# EAGLE design MDMCv2 (EAGLE 7.7.0)
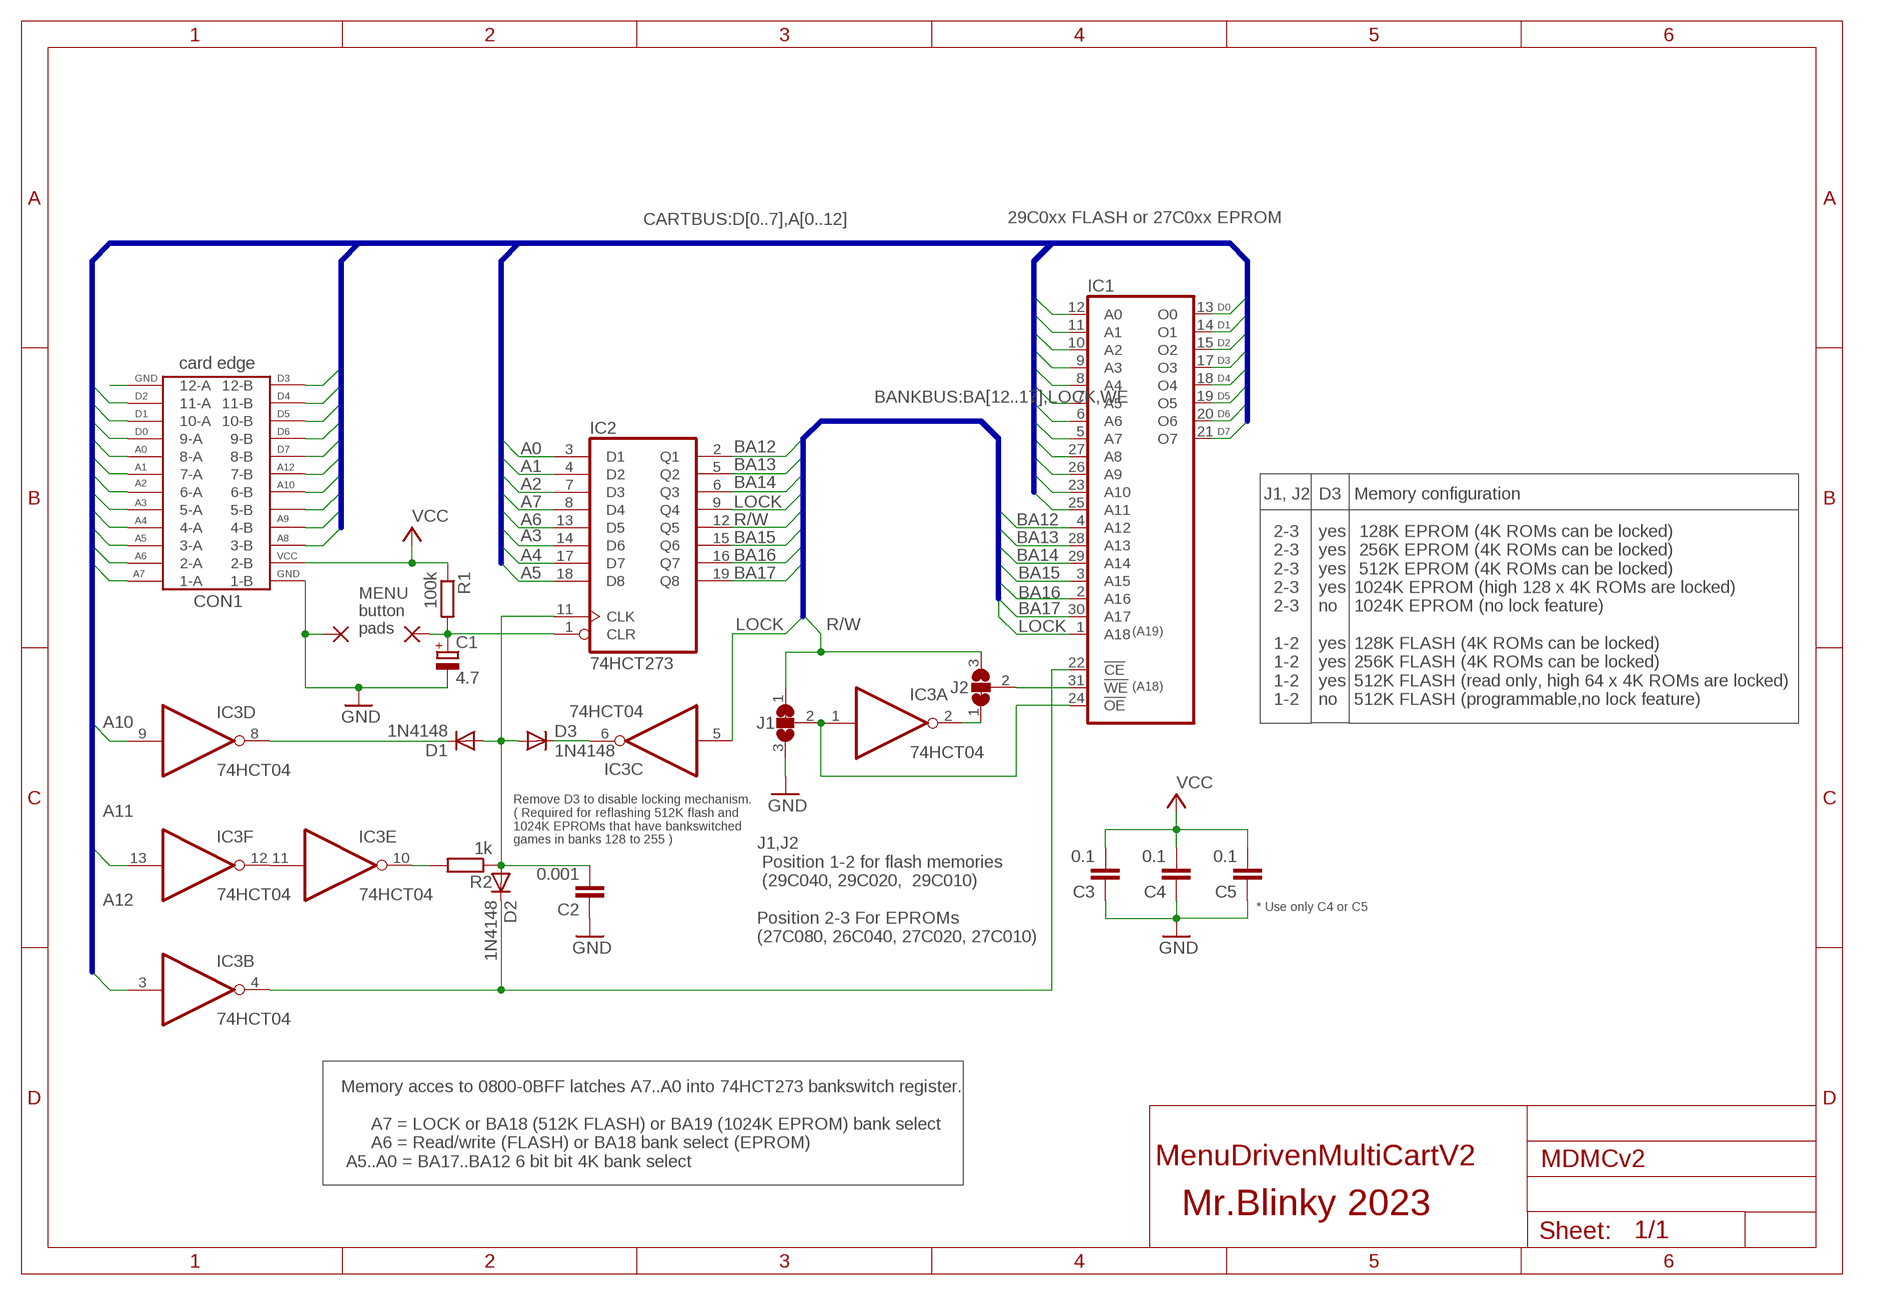
[diagram p0: schematic, sheet 1]

## Parts
C1  4.7  CPOL-EUTT2D5L  [TT2D5L]
C2  0.001  C-EU050-025X075  [C050-025X075]
C3  0.1  C-EU050-025X075  [C050-025X075]
C4  0.1  C-EU050-025X075  [C050-025X075]
C5  0.1  C-EU050-025X075  [C050-025X075]
CON1  card edge  24PINEDGE-254MM  [24PINEDGE-254MM]
D1  1N4148  1N4148DO35-7  [DO35-7]
D2  1N4148  1N4148DO35-7  [DO35-7]
D3  1N4148  1N4148DO35-7  [DO35-7]
IC1  29C0xx FLASH or 27C0xx EPROM  29C04032P6  [DIL32]
IC2  74HCT273  74HCT273N  [DIL20]
IC3  74HCT04  74LS04N  [DIL14]
J1  SJ2W  [SJ_2]
J2  SJ2W  [SJ_2]
MB1  WIREPAD1,6/0,9  [1,6/0,9]
MB2  WIREPAD1,6/0,9  [1,6/0,9]
R1  100k  R-EU_0207/7  [0207/7]
R2  1k  R-EU_0207/7  [0207/7]

## Nets
!RESET: C1.+ IC2.1(CLR) MB1.1(P) R1.2
/A10: D1.C IC3.8(D:O)
/A11: IC3.11(E:I) IC3.12(F:O)
/CE: D2.C IC1.22(!CE) IC3.4(B:O)
/LOCK: D3.C IC3.6(C:O)
/OE: IC1.24(!OE) IC3.1(A:I) J1.2
/WE: IC1.31(!WE) J2.2
/WEJ2: IC3.2(A:O) J2.1
A0: CON1.8-A IC1.12(A0) IC2.3(D1)
A1: CON1.7-A IC1.11(A1) IC2.4(D2)
A2: CON1.6-A IC1.10(A2) IC2.7(D3)
A3: CON1.5-A IC1.9(A3) IC2.14(D6)
A4: CON1.4-A IC1.8(A4) IC2.17(D7)
A5: CON1.3-A IC1.7(A5) IC2.18(D8)
A6: CON1.2-A IC1.6(A6) IC2.13(D5)
A7: CON1.1-A IC1.5(A7) IC2.8(D4)
A8: CON1.3-B IC1.27(A8)
A9: CON1.4-B IC1.26(A9)
A10: CON1.6-B IC1.23(A10) IC3.9(D:I)
A11: CON1.5-B IC1.25(A11) IC3.13(F:I)
A11B: IC3.10(E:O) R2.2
A12: CON1.7-B IC3.3(B:I)
BA12: IC1.4(A12) IC2.2(Q1)
BA13: IC1.28(A13) IC2.5(Q2)
BA14: IC1.29(A14) IC2.6(Q3)
BA15: IC1.3(A15) IC2.15(Q6)
BA16: IC1.2(A16) IC2.16(Q7)
BA17: IC1.30(A17) IC2.19(Q8)
CLK: C2.2 D1.A D2.A D3.A IC2.11(CLK) R2.1
D0: CON1.9-A IC1.13(O0)
D1: CON1.10-A IC1.14(O1)
D2: CON1.11-A IC1.15(O2)
D3: CON1.12-B IC1.17(O3)
D4: CON1.11-B IC1.18(O4)
D5: CON1.10-B IC1.19(O5)
D6: CON1.9-B IC1.20(O6)
D7: CON1.8-B IC1.21(O7)
GND: C1.- C2.1 C3.1 C4.1 C5.1 CON1.1-B CON1.12-A J1.3 MB2.1(P)
LOCK: IC1.1(A18) IC2.9(Q4) IC3.5(C:I)
R/W: IC2.12(Q5) J1.1 J2.3
VCC: C3.2 C4.2 C5.2 CON1.2-B R1.1

## Buses
CARTBUS:D[0..7],A[0..12]
BANKBUS:BA[12..17],LOCK,WE

## Notes on the sheet
- MENU
  button
  pads
- (A19)
- (A18)
- J1, J2
  
    2-3
    2-3
    2-3
    2-3
    2-3
  
    1-2
    1-2
    1-2
    1-2
- D3
  
  yes
  yes
  yes
  yes
  no
  
  yes
  yes
  yes
  no
- Memory configuration
  
   128K EPROM (4K ROMs can be locked)
   256K EPROM (4K ROMs can be locked)
   512K EPROM (4K ROMs can be locked)
  1024K EPROM (high 128 x 4K ROMs are locked)
  1024K EPROM (no lock feature)
  
  128K FLASH (4K ROMs can be locked)
  256K FLASH (4K ROMs can be locked)
  512K FLASH (read only, high 64 x 4K ROMs are locked)
  512K FLASH (programmable,no lock feature)
- Remove D3 to disable locking mechanism.
  ( Required for reflashing 512K flash and
  1024K EPROMs that have bankswitched 
  games in banks 128 to 255 )
- * Use only C4 or C5
- J1,J2
   Position 1-2 for flash memories
   (29C040, 29C020,  29C010)
  
  Position 2-3 For EPROMs
  (27C080, 26C040, 27C020, 27C010)
- MenuDrivenMultiCartV2
- Memory acces to 0800-0BFF latches A7..A0 into 74HCT273 bankswitch register.
  
        A7 = LOCK or BA18 (512K FLASH) or BA19 (1024K EPROM) bank select
        A6 = Read/write (FLASH) or BA18 bank select (EPROM)
   A5..A0 = BA17..BA12 6 bit bit 4K bank select
- Mr.Blinky 2023

## Power pins joined to a net without a drawn wire
GND: IC1.16(GND) IC2.10(GND) IC3.7(P:GND)
VCC: IC1.32(VCC) IC2.20(VCC) IC3.14(P:VCC)

## Library data of the parts
C1 = rcl:CPOL-EU: POLARIZED CAPACITOR, European symbol
C2-C5 = rcl:C-EU: CAPACITOR, European symbol
CON1 = ataricon-edge:24PINEDGE-254MM: 24 PIN EDGE CONNECTOR 2.54mm ATARI 2600 CARTRIDGE PORT
D1-D3 = diode:1N4148: DIODE high speed (Philips)
IC1 = atmel:29C040: 4-Megabit (512Kx8) FLASH
IC2 = 74xx-eu:74*273: Octal D type FLIP FLOP, clear
IC3 = 74xx-us:74*04: Hex INVERTER
J1 J2 = jumper:SJ2W: SMD solder JUMPER
MB1 MB2 = wirepad:WIREPAD: Wire PAD connect wire on PCB
R1 R2 = rcl:R-EU_: RESISTOR, European symbol

## Board
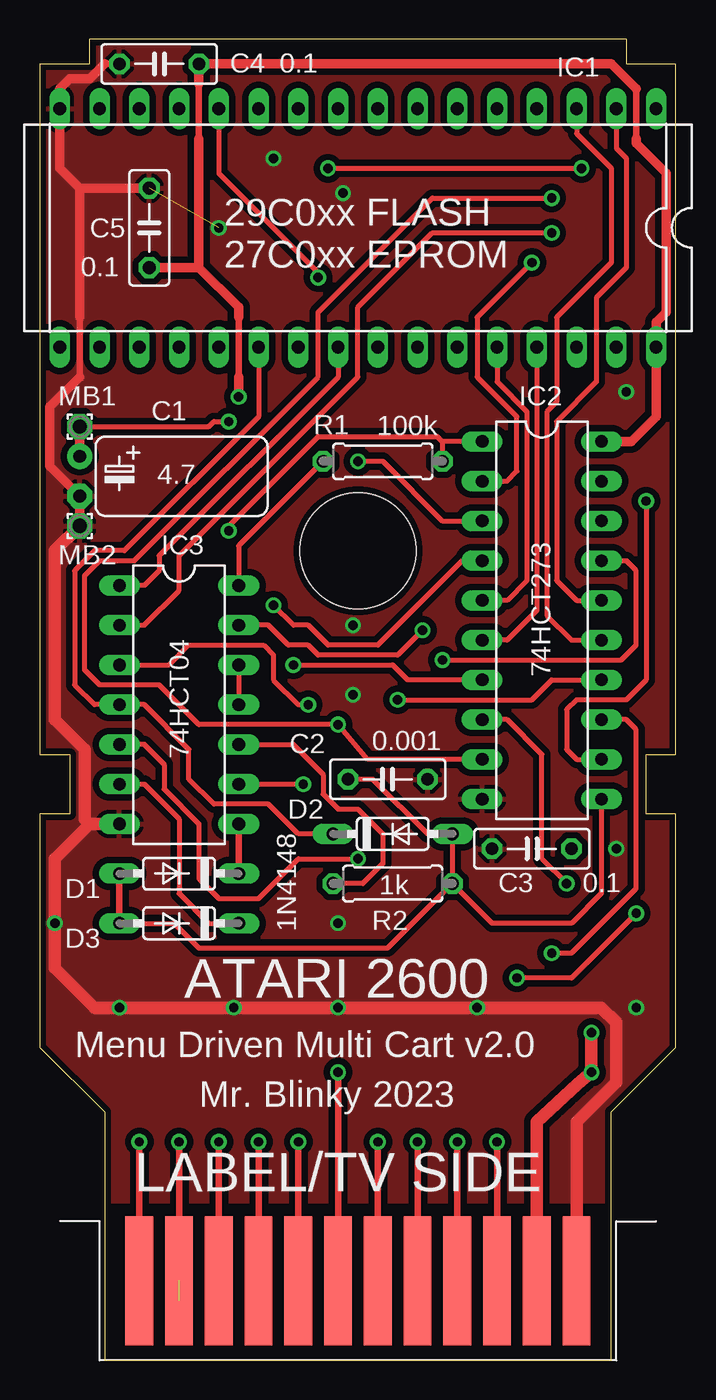
[diagram p1: board, top side]
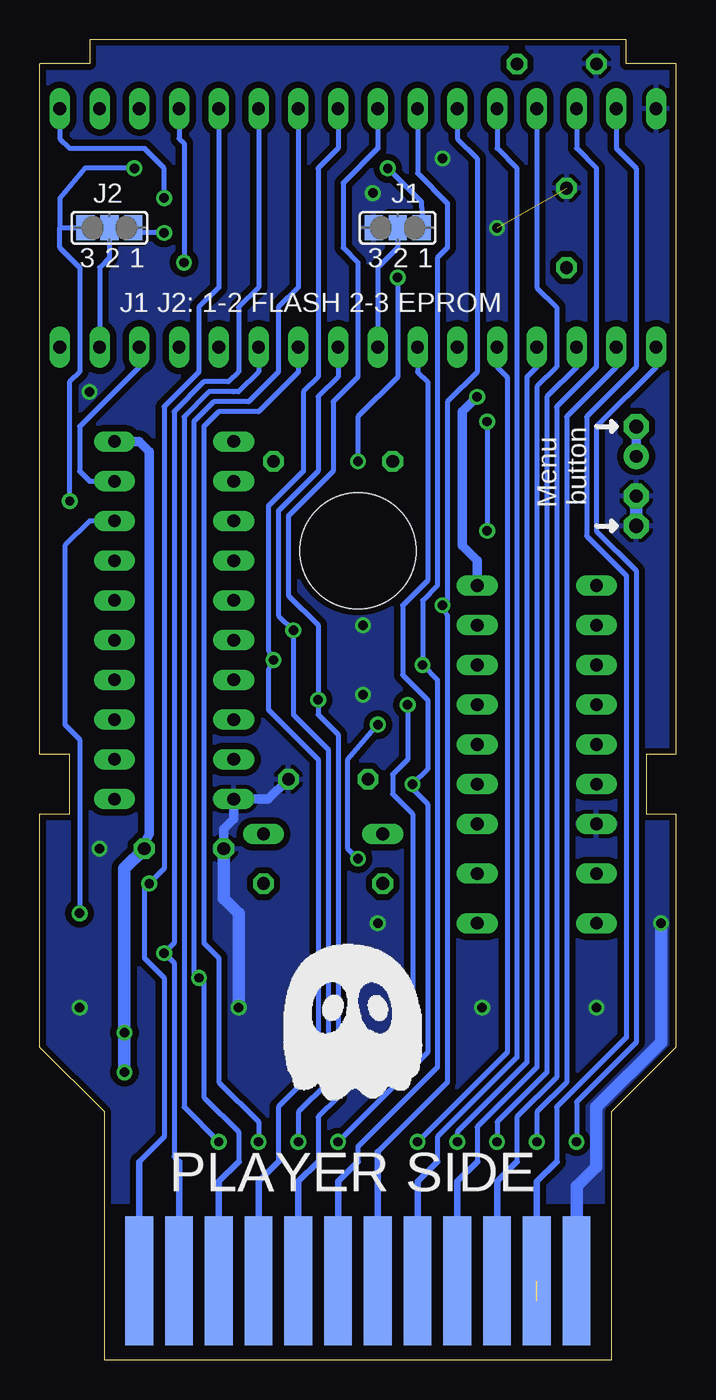
[diagram p2: board, bottom side, seen from below]

Size 40.64 x 84.46 mm. Coordinates in mm from the lower left corner, seen from the top.
Outline: 4.13,0 36.51,0 36.51,15.88 40.64,20 40.64,34.92 38.73,34.92 38.73,38.73 40.64,38.73 40.64,82.87 37.47,82.87 37.47,84.46 3.18,84.46 3.18,82.87 0,82.87 0,38.73 1.91,38.73 1.91,34.92 0,34.92 0,20 4.13,15.88 4.13,0
Copper layers (1*16): Top 0.035mm / dielectric 1.5mm / Bottom 0.035mm
Design rules "default *": minimum track width 8mil, minimum drill 0.3mm, track to track 6mil, track to pad 6mil, pad to pad 6mil, via to via 6mil, smd to smd 6mil, copper to edge 12mil, drill to drill 8mil, minimum pad ring 10mil, minimum via ring 8mil, stop-mask expansion 4mil, vias tented up to drill 30mil, thermal gap 10mil
Holes 7.41 mm at 20.32,51.75

### Footprints (pad centres in the part's own frame; a part is rotated, then mirrored left to right if it is on the bottom)
TT2D5L = drill 0.813 pad 1.6: + -1.27,0 | drill 0.813 pad 1.6 octagon: - 1.27,0
C050-025X075 = drill 0.813 octagon: 1 -2.54,0; 2 2.54,0
24PINEDGE-254MM = smd 1.778 x 8.255: 1-A -22.86,-7.62; 2-A -20.32,-7.62; 3-A -17.78,-7.62; 4-A -15.24,-7.62; 5-A -12.7,-7.62; 6-A -10.16,-7.62; 7-A -7.62,-7.62; 8-A -5.08,-7.62; 9-A -2.54,-7.62; 10-A 0,-7.62; 11-A 2.54,-7.62; 12-A 5.08,-7.62 | smd 1.778 x 8.255 bottom: 1-B -22.86,-7.62; 2-B -20.32,-7.62; 3-B -17.78,-7.62; 4-B -15.24,-7.62; 5-B -12.7,-7.62; 6-B -10.16,-7.62; 7-B -7.62,-7.62; 8-B -5.08,-7.62; 9-B -2.54,-7.62; 10-B 0,-7.62; 11-B 2.54,-7.62; 12-B 5.08,-7.62
DO35-7 = drill 0.813 long: A 3.81,0; C -3.81,0
DIL32 = drill 0.813 long: 1 -19.05,-7.62; 2 -16.51,-7.62; 3 -13.97,-7.62; 4 -11.43,-7.62; 5 -8.89,-7.62; 6 -6.35,-7.62; 7 -3.81,-7.62; 8 -1.27,-7.62; 9 1.27,-7.62; 10 3.81,-7.62; 11 6.35,-7.62; 12 8.89,-7.62; 13 11.43,-7.62; 14 13.97,-7.62; 15 16.51,-7.62; 16 19.05,-7.62; 17 19.05,7.62; 18 16.51,7.62; 19 13.97,7.62; 20 11.43,7.62; 21 8.89,7.62; 22 6.35,7.62; 23 3.81,7.62; 24 1.27,7.62; 25 -1.27,7.62; 26 -3.81,7.62; 27 -6.35,7.62; 28 -8.89,7.62; 29 -11.43,7.62; 30 -13.97,7.62; 31 -16.51,7.62; 32 -19.05,7.62
DIL20 = drill 0.813 long: 1 -11.43,-3.81; 2 -8.89,-3.81; 3 -6.35,-3.81; 4 -3.81,-3.81; 5 -1.27,-3.81; 6 1.27,-3.81; 7 3.81,-3.81; 8 6.35,-3.81; 9 8.89,-3.81; 10 11.43,-3.81; 11 11.43,3.81; 12 8.89,3.81; 13 6.35,3.81; 14 3.81,3.81; 15 1.27,3.81; 16 -1.27,3.81; 17 -3.81,3.81; 18 -6.35,3.81; 19 -8.89,3.81; 20 -11.43,3.81
DIL14 = drill 0.813 long: 1 -7.62,-3.81; 2 -5.08,-3.81; 3 -2.54,-3.81; 4 0,-3.81; 5 2.54,-3.81; 6 5.08,-3.81; 7 7.62,-3.81; 8 7.62,3.81; 9 5.08,3.81; 10 2.54,3.81; 11 0,3.81; 12 -2.54,3.81; 13 -5.08,3.81; 14 -7.62,3.81
SJ_2 = smd 1.168 x 1.6: 1 -1.524,0; 2 0,0; 3 1.524,0
1,6/0,9 = drill 0.914 pad 1.6 octagon: 1 0,0
0207/7 = drill 0.813 octagon: 1 -3.81,0; 2 3.81,0

### Placement (x,y rotation side)
C1  2.54,56.52 270 top
C2  22.22,37.15 180 top
C3  31.43,32.7 0 top
C4  7.62,82.87 0 top
C5  6.98,72.39 270 top
CON1  11.43,12.7 0 bottom
D1  8.89,31.12 180 top
D2  22.54,33.66 0 top
D3  8.89,27.94 180 top
IC1  20.32,72.39 180 top
IC2  32.07,47.31 270 top
IC3  8.89,41.91 270 top
J1  17.78,72.39 180 bottom
J2  36.19,72.39 180 bottom
MB1  2.54,59.69 180 top
MB2  2.54,53.34 180 top
R1  21.91,57.47 0 top
R2  22.54,30.48 180 top

### Tracks (layer width: path | path; a pad name or v marks a point on that pad's centre or on a via)
!RESET  (via drill 0.6)
  Top 0.305: IC2.1 25.72,58.74 | 25.72,58.74 R1.2 | MB1.1 10.79,59.69 11.11,60.01 v12.07,60.01 | v12.07,53.02 12.07,53.34 17.78,59.05 25.4,59.05 25.72,58.74
  Top 0.61: C1.+ MB1.1
  Bottom 0.305: v12.07,60.01 v12.07,53.02
  Bottom 0.61: MB1.1 C1.+
/A10
  Top 0.406: D1.C IC3.8
/A11
  Top 0.305: IC3.12 IC3.11
/CE
  Top 0.305: IC1.22 13.97,60.33 5.4,51.75 3.49,51.75 2.22,50.48 2.22,43.18 3.49,41.91 IC3.4 6.67,41.91 9.52,39.05 9.52,37.15 11.11,35.56 14.61,35.56 16.51,33.66 D2.C
/LOCK
  Top 0.305: IC3.6 6.67,36.83 8.89,34.61 8.89,29.84 10.79,27.94 D3.C
/OE
  Top 0.305: IC1.24 19.05,62.87 7.62,51.44 7.62,50.48 6.67,49.53 IC3.1
  Bottom 0.305: J1.2 17.78,71.12 19.05,69.85 IC1.24
/WE
  Bottom 0.305: J2.2 36.19,70.49 36.83,69.85 IC1.31
/WEJ2  (via drill 0.6)
  Top 0.305: IC3.2 6.67,46.99 8.89,49.21 8.89,51.44 20.32,62.87 20.32,67.31 25.08,72.07 v32.7,72.07
  Bottom 0.305: v32.7,72.07 34.29,72.07 34.61,72.39 J2.1
A0  (via drill 0.6)
  Top 0.305: IC1.12 11.43,75.88 17.78,69.53 v17.78,69.22 | v20.32,57.47 21.91,57.47 25.72,53.66 IC2.3
  Bottom 0.305: IC1.12 11.43,77.47 10.16,76.2 10.16,19.37 15.24,14.29 15.24,12.7 | v17.78,69.22 17.78,62.87 20.32,60.33 v20.32,57.47
  Bottom 0.406: 15.24,12.7 16.51,11.43 CON1.8-A
A1  (via drill 0.6)
  Top 0.305: IC2.4 26.99,51.12 21.59,45.72 18.42,45.72 17.14,46.99 16.19,46.99 v14.92,48.26 14.61,48.26
  Bottom 0.305: IC1.11 13.97,78.1 12.7,76.84 12.7,63.18 14.61,61.28 14.61,48.58 v14.92,48.26 14.61,47.62 14.61,17.78 19.05,13.34
  Bottom 0.406: 19.05,13.34 CON1.7-A
A2  (via drill 0.6)
  Top 0.305: IC2.7 23.5,43.5 22.54,44.45 v16.19,44.45
  Bottom 0.305: IC1.10 16.51,75.88 14.61,73.98 14.61,71.12 15.24,70.49 15.24,49.53 16.19,48.58 v16.19,44.45 15.24,43.5 15.24,18.73 20.32,13.65 20.32,12.7
  Bottom 0.406: 20.32,12.7 21.59,11.43 CON1.6-A
A3  (via drill 0.6)
  Top 0.305: v22.86,42.23 31.43,42.23 32.7,43.5 IC2.14
  Bottom 0.305: IC1.9 19.05,77.47 21.27,75.25 21.27,71.12 20.32,70.17 20.32,62.87 21.91,61.28 21.91,56.83 24.76,53.98 24.76,48.9 22.86,46.99 v22.86,42.23 22.86,41.27 21.59,40.01 21.59,16.83 22.86,15.56 22.86,12.7
  Bottom 0.406: 22.86,12.7 24.13,11.43 CON1.5-A
A4  (via drill 0.6)
  Top 0.305: v25.72,44.77 37.15,44.77 38.1,45.72 38.1,50.48 37.47,51.12 IC2.17
  Bottom 0.305: IC1.8 21.59,77.47 22.86,76.2 22.86,62.87 23.81,61.91 23.81,56.83 26.04,54.61 26.04,45.4 v25.72,44.77 26.04,44.13 26.04,41.59 22.86,38.42 22.86,18.73 25.4,16.19 25.4,12.7 | 26.67,4.13 CON1.4-A 26.67,4.45
  Bottom 0.406: 25.4,12.7 26.67,11.43 CON1.4-A
A5  (via drill 0.6)
  Top 0.305: v38.1,28.57 33.97,24.45 v30.48,24.45
  Bottom 0.305: IC1.7 24.13,68.58 25.4,67.31 25.4,63.18 27.3,61.28 29.53,61.28 30.8,60.01 30.8,24.77 v30.48,24.45 30.16,24.13 30.16,16.83 27.94,14.61 27.94,12.7 | 29.21,3.81 CON1.3-A | IC2.18 37.47,53.66 39.05,52.07 39.05,40.64 38.1,39.69 v38.1,28.57
  Bottom 0.406: 27.94,12.7 29.21,11.43 CON1.3-A
A6  (via drill 0.6)
  Top 0.305: v32.7,26.04 33.97,26.04 38.1,30.16 38.1,40.32 37.47,40.96 IC2.13
  Bottom 0.305: IC1.6 26.67,68.58 27.94,67.31 27.94,63.18 28.57,62.55 30.16,62.55 32.07,60.64 32.07,26.67 v32.7,26.04 32.07,25.4 32.07,13.02 31.75,12.7
  Bottom 0.406: 31.75,12.7 CON1.2-A
A7  (via drill 0.6)
  Top 0.305: v33.66,30.48 32.07,32.07 32.07,38.73 29.85,40.96 IC2.8
  Bottom 0.305: IC1.5 29.21,68.58 30.48,67.31 30.48,63.18 32.7,60.96 32.7,31.43 v33.66,30.48 33.97,30.16 33.97,25.72 32.7,24.45 32.7,14.29 34.29,12.7
  Bottom 0.406: 34.29,12.7 CON1.1-A
A8  (via drill 0.6)
  Top 0.305: 29.21,2.86 CON1.3-B | CON1.3-B 29.21,5.71 28.89,6.03 28.89,5.4 CON1.3-B
  Top 0.406: v29.21,13.97 29.21,5.71
  Bottom 0.305: IC1.27 26.67,63.18 27.94,61.91 28.26,61.91 29.85,61.91 31.43,60.33 31.43,16.19 v29.21,13.97
A9  (via drill 0.6)
  Top 0.406: v26.67,13.97 CON1.4-B
  Bottom 0.305: IC1.26 24.13,63.18 26.67,60.64 29.21,60.64 30.16,59.69 30.16,26.67 29.21,25.72 29.21,17.78 26.67,15.24 v26.67,13.97
A10  (via drill 0.6)
  Top 0.305: IC3.9 v16.83,36.83
  Top 0.406: v21.59,13.97 CON1.6-B
  Bottom 0.305: IC1.23 16.51,63.18 15.88,62.55 15.88,49.85 17.46,48.26 17.46,43.81 15.88,42.23 15.88,37.78 v16.83,36.83 16.83,36.51 15.88,35.56 15.88,19.69 v21.59,13.97
A11  (via drill 0.6)
  Top 0.305: v24.45,46.67 22.86,45.09 17.78,45.09 17.14,45.72 15.88,45.72 14.61,46.99 IC3.13
  Top 0.406: v24.13,13.97 CON1.5-B
  Bottom 0.305: IC1.25 21.59,62.87 22.86,61.59 22.86,56.83 25.4,54.29 25.4,47.62 v24.45,46.67 24.45,41.27 22.22,39.05 22.22,17.78 24.13,15.88 v24.13,13.97
A11B
  Top 0.305: IC3.10 16.19,39.37 18.1,37.47 18.1,36.2 19.05,35.24 20.32,35.24 21.91,33.66 21.91,31.75 20.64,30.48 R2.2
A12  (via drill 0.6)
  Top 0.305: IC3.3 8.25,44.45 9.52,45.72 14.29,45.72 14.92,45.09 14.92,43.5 16.51,41.91 v17.14,41.91
  Top 0.406: CON1.7-B v19.05,18.41
  Bottom 0.305: v17.14,41.91 17.14,38.42 18.1,37.47 18.1,36.2 16.83,34.92 16.83,20.64 v19.05,18.41
BA12  (via drill 0.6)
  Top 0.305: IC2.2 29.85,56.2 30.48,56.83 30.48,60.33 27.94,62.87 27.94,66.67 v31.43,70.17
  Bottom 0.305: IC1.4 31.75,78.1 31.43,77.79 v31.43,70.17
BA13
  Top 0.305: IC1.28 29.21,62.55 31.11,60.64 31.11,49.85 29.85,48.58 IC2.5
BA14
  Top 0.305: IC1.29 31.75,47.94 29.85,46.04 IC2.6
BA15
  Top 0.305: IC1.3 34.29,78.42 36.51,76.2 36.51,70.17 33.02,66.67 33.02,61.28 32.39,60.64 32.39,47.62 33.97,46.04 IC2.15
BA16
  Top 0.305: IC1.2 36.83,77.47 37.47,76.84 37.47,69.85 35.56,67.94 35.56,62.55 33.02,60.01 33.02,49.85 34.29,48.58 IC2.16
BA17
  Bottom 0.305: IC1.30 34.29,63.5 38.1,59.69 38.1,56.83 37.47,56.2 IC2.19
CLK
  Top 0.305: IC2.11 35.88,29.84 33.97,27.94 28.89,27.94 R2.1 | C2.2 21.27,37.15 24.76,33.66 D2.A R2.1 | D3.A 8.57,27.94 10.16,26.35 22.22,26.35 R2.1 | R2.1 26.35,30.16
  Top 0.406: D1.A D3.A
D0
  Bottom 0.305: IC1.13 8.89,68.58 7.62,67.31 7.62,63.5 8.89,62.23 8.89,18.73 12.7,14.92 12.7,12.7 | 13.97,3.18 CON1.9-A
  Bottom 0.406: 12.7,12.7 13.97,11.43 CON1.9-A
D1
  Bottom 0.305: IC1.14 6.35,77.47 5.08,76.2 5.08,63.5 7.62,60.96 7.62,18.1 10.16,15.56 10.16,12.7 | 11.43,3.81 CON1.10-A
  Bottom 0.406: 10.16,12.7 11.43,11.43 CON1.10-A
D2  (1 unrouted)
  Bottom 0.305: IC1.15 3.81,77.47 2.54,76.2 2.54,63.5 5.71,60.33 5.71,52.7 3.18,50.16 3.18,20.64 7.62,16.19 7.62,12.7
  Bottom 0.406: 7.62,12.7 8.89,11.43 8.89,3.81
D3  (via drill 0.6)
  Top 0.406: v6.35,13.97 6.35,8.89 6.98,8.26 6.98,5.71 CON1.12-B
  Bottom 0.305: IC1.17 1.27,63.5 5.08,59.69 5.08,53.02 2.54,50.48 2.54,20.32 6.35,16.51 v6.35,13.97
D4  (via drill 0.6)
  Top 0.406: v8.89,13.97 CON1.11-B 8.89,4.45
  Bottom 0.305: IC1.18 3.81,63.5 6.98,60.33 6.98,17.78 8.89,15.88 v8.89,13.97
D5  (via drill 0.6)
  Top 0.406: v11.43,13.97 CON1.10-B
  Bottom 0.305: IC1.19 6.35,63.5 8.25,61.59 8.25,18.41 11.43,15.24 v11.43,13.97
D6  (via drill 0.6)
  Top 0.406: v13.97,13.97 CON1.9-B 13.97,1.91
  Bottom 0.305: IC1.20 8.89,63.5 9.52,62.87 9.52,19.05 13.97,14.61 v13.97,13.97
D7  (via drill 0.6)
  Top 0.406: v16.51,13.97 CON1.8-B
  Bottom 0.305: IC1.21 11.43,63.5 10.79,62.87 10.79,19.69 v16.51,13.97
GND  (via drill 0.6)  (1 unrouted)
  Top 0.406: C4.1 4.13,82.87 | 2.54,66.67 2.54,62.87
  Top 0.61: 4.13,82.87 3.18,81.91 1.91,81.91 1.27,81.28 IC1.16 1.27,76.2 2.54,74.93 | MB2.1 C1.- 0.63,57.15 0.63,60.96 2.54,62.87 | 2.54,74.93 2.54,66.67 | C5.1 2.54,74.93
  Top 0.813: CON1.1-B 34.29,15.24 36.83,17.78 36.83,21.59 35.88,22.54 v27.94,22.54 3.49,22.54 0.95,25.08 v0.95,27.94 0.95,32.07 3.18,34.29 | 3.18,34.29 IC3.7 | MB2.1 0.95,51.75 0.95,40.96 2.86,39.05 2.86,34.61 3.18,34.29
  Bottom 0.61: C2.1 26.04,35.88 IC2.10 28.26,34.61 28.89,33.97 C3.1
  Bottom 0.813: CON1.12-A 6.35,11.11 5.08,12.38 5.08,16.19 0.95,20.32 v0.95,27.94 | C3.1 28.89,29.53 27.94,28.57 v27.94,22.54 | C1.- MB2.1
  other vias: 20,42.55 19.05,22.54 12.38,22.54 19.05,27.94 38.1,22.54 20,46.99 14.92,76.84 11.43,72.39 37.47,61.91 36.83,32.7 5.08,22.54 19.37,74.61
  pour Top (isolate 0.406): -1.27,10.79 -1.27,84.46 -0.63,85.09 40.64,85.09 41.91,83.82 41.91,10.79 41.28,10.16 -0.63,10.16
  pour Bottom (isolate 0.406): -2.54,10.16 -2.54,85.72 41.91,85.72 41.91,10.16
LOCK  (via drill 0.6)
  Top 0.305: IC3.5 6.67,39.37 7.94,38.1 7.94,36.51 10.16,34.29 10.16,30.8 11.43,29.53 13.97,29.53 16.51,32.07 v20.32,32.07 | IC2.9 20.96,38.42 v19.05,40.64 10.16,40.64 7.62,43.18 3.81,43.18 2.86,44.13 2.86,50.16 3.81,51.12 6.03,51.12 17.78,62.87 17.78,66.99 25.08,74.29 v32.7,74.29
  Bottom 0.305: v20.32,32.07 20.96,32.7 20.96,38.42 v19.05,40.64 | IC1.1 39.37,78.1 38.73,77.47 33.97,77.47 32.7,76.2 v32.7,74.29
R/W  (via drill 0.6)
  Top 0.305: v18.42,76.2 v34.61,76.2 | v38.73,54.93 38.73,43.5 37.47,42.23 34.29,42.23 33.66,41.59 33.66,39.05 34.29,38.42 IC2.12
  Bottom 0.305: 39.37,72.39 39.37,71.12 38.1,69.85 38.1,63.18 38.73,62.55 v38.73,54.93 | v18.42,76.2 16.26,74.04 16.26,73.72 16.19,72.39 J1.1 | v34.61,76.2 37.78,76.2 39.37,74.29 39.37,72.39 | 39.37,72.39 J2.3
VCC  (via drill 0.6)
  Top 0.305: R1.1 12.7,52.07 IC3.14
  Top 0.406: 38.1,81.28 38.1,78.1 | 12.7,62.87 12.7,66.67 | 10.16,78.1 10.16,81.6
  Top 0.61: 38.1,81.28 36.51,82.87 C4.2 10.16,81.6 | 38.1,78.1 38.1,77.79 40,75.88 40,66.99 39.37,66.36 IC1.32 39.37,60.33 37.78,58.74 IC2.20 | v12.7,61.59 12.7,62.87 | 12.7,66.67 12.7,67.31 10.16,69.85 | 10.16,69.85 10.16,78.1 | 35.24,18.39 34.36,17.68 | C5.2 10.16,69.85
  Top 0.813: CON1.2-B 31.75,15.24 34.36,17.68 v35.24,18.41 | v35.24,20.96 35.24,18.39
  Bottom 0.61: IC3.14 12.7,51.12 13.65,52.07 13.65,60.64 v12.7,61.59 | IC2.20 34.29,58.74 33.66,58.1 33.66,33.66 33.97,33.02
  Bottom 0.813: v35.24,18.41 v35.24,20.96 35.24,31.43 C3.2 33.97,33.02

### Text on the board
tPlace: 29C0xx FLASH / 27C0xx EPROM | ATARI 2600 | Menu Driven Multi Cart v2.0 | Mr. Blinky 2023 | LABEL/TV SIDE
bNames: 1 | 2 | 3 | 1 | 2 | 3 | J1 J2: 1-2 FLASH 2-3 EPROM | button | Menu | PLAYER SIDE